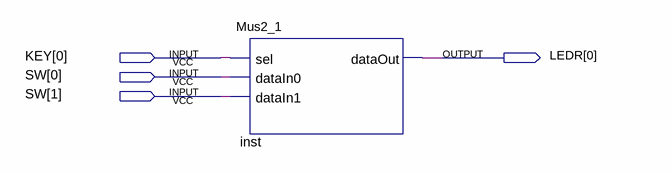
[diagram p0: schematic sheet]
// Quartus schematic Mux2_1Demo.bdf as structural Verilog: 1 symbols, 4 pins
module Mux2_1Demo (
  input  [0:0] KEY,
  input  [1:0] SW,
  output [0:0] LEDR
);

  Mus2_1 inst (.sel(KEY[0]), .dataIn0(SW[0]), .dataIn1(SW[1]), .dataOut(LEDR[0]));
endmodule
